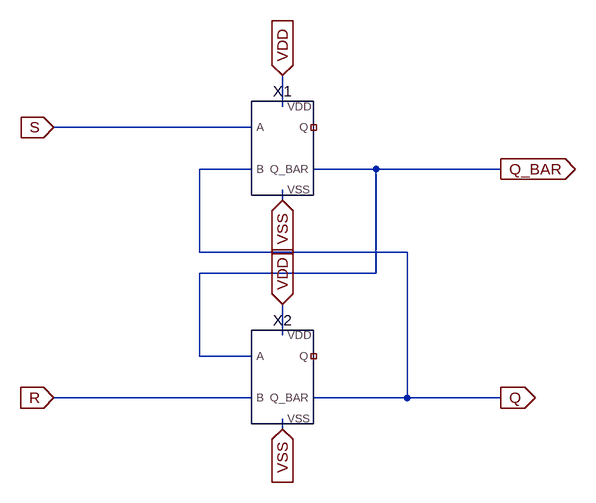
[diagram p0: schematic my_sr_flipflop.asc]
my_sr_flipflop.asc, the LTspice schematic file:
Version 4
SHEET 1 1048 700
WIRE 224 112 224 64
WIRE 176 144 -128 144
WIRE 176 208 96 208
WIRE 368 208 272 208
WIRE 560 208 368 208
WIRE 224 256 224 240
WIRE 96 336 96 208
WIRE 416 336 96 336
WIRE 368 368 368 208
WIRE 368 368 96 368
WIRE 224 464 224 416
WIRE 96 496 96 368
WIRE 176 496 96 496
WIRE 176 560 -128 560
WIRE 416 560 416 336
WIRE 416 560 272 560
WIRE 560 560 416 560
WIRE 224 608 224 592
FLAG 224 64 VDD
IOPIN 224 64 In
FLAG 224 416 VDD
IOPIN 224 416 In
FLAG -128 144 S
IOPIN -128 144 In
FLAG -128 560 R
IOPIN -128 560 In
FLAG 560 208 Q_BAR
IOPIN 560 208 Out
FLAG 560 560 Q
IOPIN 560 560 Out
FLAG 224 256 VSS
IOPIN 224 256 In
FLAG 224 608 VSS
IOPIN 224 608 In
SYMBOL my_cmos_or 224 176 R0
SYMATTR InstName X1
SYMBOL my_cmos_or 224 528 R0
SYMATTR InstName X2

The netlist it stands for:
* my_sr_flipflop.asc
XX1 S Q VDD VSS NC_01 Q_BAR my_cmos_or  ; pins A B VDD VSS Q Q_BAR
XX2 Q_BAR R VDD VSS NC_02 Q my_cmos_or  ; pins A B VDD VSS Q Q_BAR
.backanno
.end